# EAGLE design progr_voltage_src (EAGLE 9.6.2)
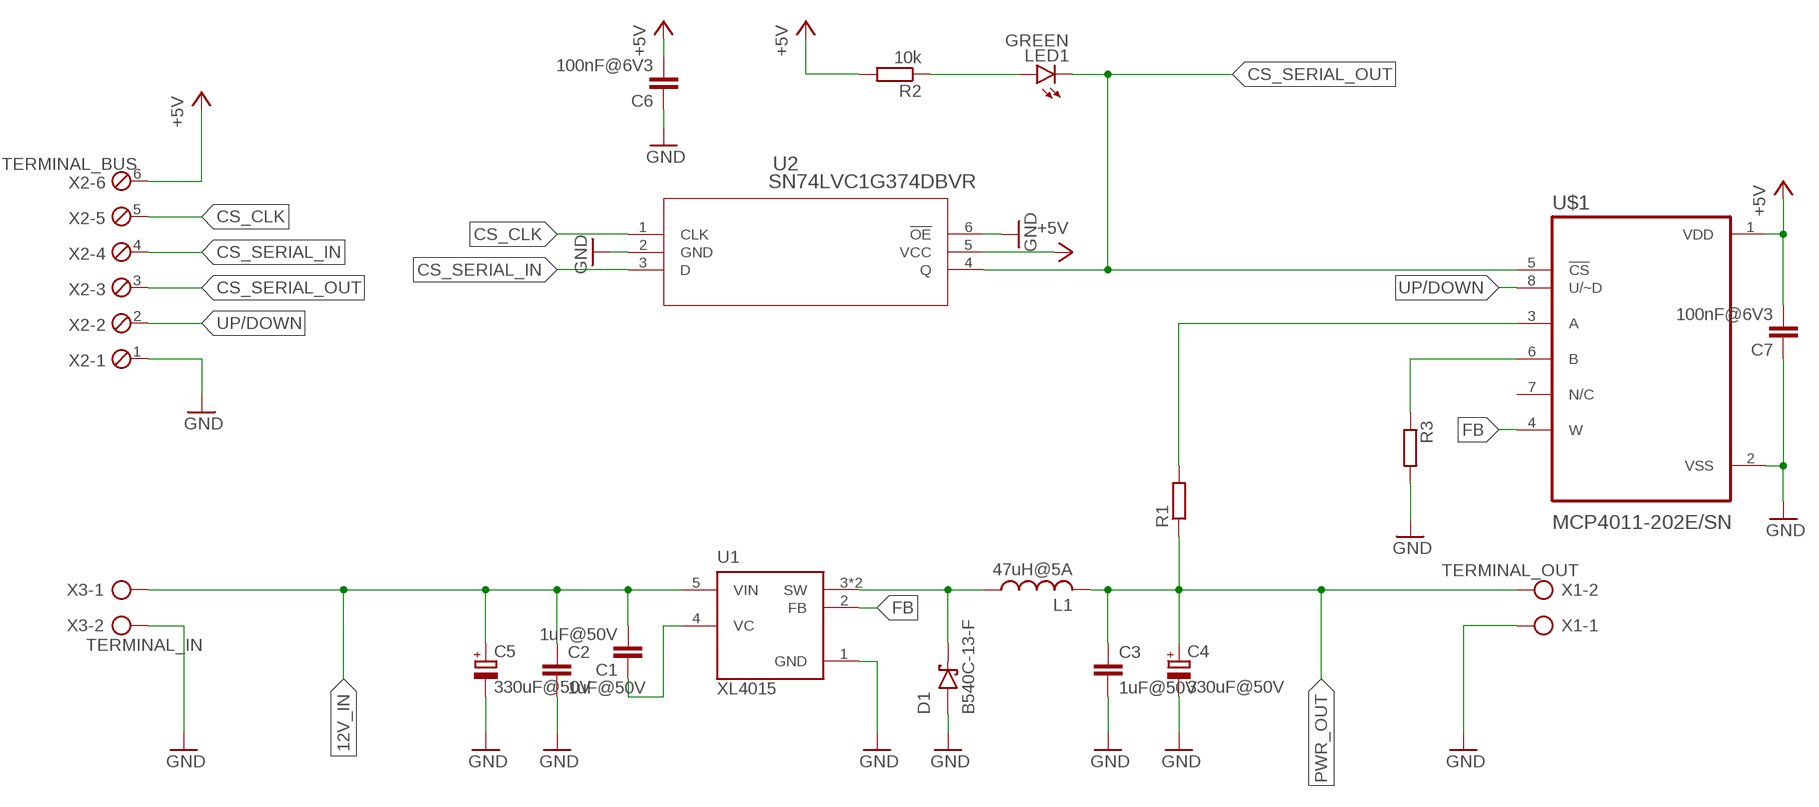
[diagram p0: schematic, sheet 1]

## Parts
C1  1uF@50V  C-EUC0603  [C0603]
C2  1uF@50V  C-EUC0603  [C0603]
C3  1uF@50V  C-EUC0603  [C0603]
C4  330uF@50V  CPOL-EUUD-6,3X7,7  [UD-6,3X7,7_NICHICON]
C5  330uF@50V  CPOL-EUUD-6,3X7,7  [UD-6,3X7,7_NICHICON]
C6  100nF@6V3  C-EUC0603  [C0603]
C7  100nF@6V3  C-EUC0603  [C0603]
D1  B540C-13-F  [DIOM6959X245N]
L1  47uH@5A  SMD_INDUCTOR_13X12X6  [SMD_INDUCTOR_13X12X6]
LED1  GREEN  LED3MM  [LED3MM]
R1  R-EU_R0603  [R0603]
R2  10k  R-EU_R0603  [R0603]
R3  R-EU_R0603  [R0603]
U1  XL4015  [CONV_XL4015]
U2  SN74LVC1G374DBVR  [DBV6]
U$1  MCP4011-202E/SN  [SOIC127P600X175-8N]
X1  TERMINAL_OUT  AK500/2  [AK500/2]
X2  TERMINAL_BUS  MPT6  [6POL254]
X3  TERMINAL_IN  AK500/2  [AK500/2]

## Nets
12V_IN: C1.2 C2.1 C5.+ U1.5(VIN) X3.1
+5V: C6.2 C7.2 R2.2 U2.5(VCC) U$1.1(VDD) X2.6
CS_CLK: U2.1(CLK) X2.5
CS_SERIAL_IN: U2.3(D) X2.4
CS_SERIAL_OUT: LED1.K(C) U2.4(Q) U$1.5(!CS) X2.3
FB: U1.2(FB) U$1.4(W)
GND: C2.2 C3.2 C4.- C5.- C6.1 C7.1 D1.A R3.2 U1.1(GND) U2.2(GND) U2.6(!OE) U$1.2(VSS) X1.1 X2.1 X3.2
N$1: D1.C(K) L1.P$1 U1.3(SW) U1.3.1(SW)
N$2: LED1.A R2.1
N$4: C1.1 U1.4(VC)
N$5: R3.1 U$1.6(B)
N$6: R1.2 U$1.3(A)
PWR_OUT: C3.1 C4.+ L1.P$2 R1.1 X1.2
UP/DOWN: U$1.8(U/~D) X2.2
Unconnected: U$1.7(N/C)

## Library data of the parts
C1-C3 C6 C7 = rcl:C-EU: CAPACITOR, European symbol; SPICEPREFIX: C
C4 C5 = rcl:CPOL-EU: POLARIZED CAPACITOR, European symbol; SPICEPREFIX: C
D1 = B540C-13-F:B540C-13-F: Diode, Schottky, 5a, 40v, Do-214ab-2, Full Reel Check availability <https://pricing.snapeda.com/parts/B540C-13-F/Diodes%20Inc./view-part?ref=eda>; AVAILABILITY: In Stock; CHECK_PRICES: https://www.snapeda.com/parts/B540C-13-F/Diodes+Inc./view-part/?ref=eda; DESCRIPTION: Diode Schottky 40 V 5A Surface Mount SMC; MF: Diodes Inc.; MP: B540C-13-F; PACKAGE: DO-214 Diodes Inc.; PRICE: None; PURCHASE-URL: https://pricing.snapeda.com/search?q=B540C-13-F&ref=eda; SNAPEDA_LINK: https://www.snapeda.com/parts/B540C-13-F/Diodes+Inc./view-part/?ref=snap
L1 = SMD_INDUCTOR_13X12X6:SMD_INDUCTOR_13X12X6
LED1 = led:LED: LED OSRAM: - CHIPLED LG R971, LG N971, LY N971, LG Q971, LY Q971, LO R971, LY R971 LH N974, LH R974 LS Q976, LO Q976, LY Q976 LO Q996 - Hyper CHIPLED LW Q18S LB Q993, LB Q99A, LB R99A - SideLED LS A670, LO A670, LY A670, LG A670, LP A670 LB A673, LV A673, LT A673, LW A673 LH A674 LY A675 LS A676, LA A676, LO A676, LY A676, LW A676 LS A679, LY A679, LG A679 - Hyper Micro SIDELED® LS Y876, LA Y876, LO Y876, LY Y876 LT Y87S - SmartLED LW L88C, LW L88S LB L89C, LB L89S, LG L890 LS L89K, LO L89K, LY L89K LS L896, LA L896, LO L896, LY L896 - TOPLED LS T670, LO T670, LY T670, LG T670, LP T670 LSG T670, LSP T670, LSY T670, LOP T670, LYG T670 LG T671, LOG T671, LSG T671 LB T673, LV T673, LT T673, LW T673 LH T674 LS T676, LA T676, LO T676, LY T676, LB T676, LH T676, LSB T676, LW T676 LB T67C, LV T67C, LT T67C, LS T67K, LO T67K, LY T67K, LW E67C LS E67B, LA E67B, LO E67B, LY E67B, LB E67C, LV E67C, LT E67C LW T67C LS T679, LY T679, LG T679 LS T770, LO T770, LY T770, LG T770, LP T770 LB T773, LV T773, LT T773, LW T773 LH T774 LS E675, LA E675, LY E675, LS T675 LS T776, LA T776, LO T776, LY T776, LB T776 LHGB T686 LT T68C, LB T68C - Hyper Mini TOPLED® LB M676 - Mini TOPLED Santana® LG M470 LS M47K, LO M47K, LY M47K Source: http://www.osram.convergy.de LUXEON: - LUMILED® LXK2-PW12-R00, LXK2-PW12-S00, LXK2-PW14-U00, LXK2-PW14-V00 LXK2-PM12-R00, LXK2-PM12-S00, LXK2-PM14-U00 LXK2-PE12-Q00, LXK2-PE12-R00, LXK2-PE12-S00, LXK2-PE14-T00, LXK2-PE14-U00 LXK2-PB12-K00, LXK2-PB12-L00, LXK2-PB12-M00, LXK2-PB14-N00, LXK2-PB14-P00, LXK2-PB14-Q00 LXK2-PR12-L00, LXK2-PR12-M00, LXK2-PR14-Q00, LXK2-PR14-R00 LXK2-PD12-Q00, LXK2-PD12-R00, LXK2-PD12-S00 LXK2-PH12-R00, LXK2-PH12-S00 LXK2-PL12-P00, LXK2-PL12-Q00, LXK2-PL12-R00 Source: www.luxeon.com KINGBRIGHT: KA-3528ASYC Source: www.kingbright.com
R1-R3 = rcl:R-EU_: RESISTOR, European symbol; SPICEPREFIX: R
U1 = XL4015:XL4015: 5A 180KHz 36V Buck DC to DC Converter Check availability <https://pricing.snapeda.com/parts/XL4015/XLSEMI/view-part?ref=eda>; AVAILABILITY: Not in stock; CHECK_PRICES: https://www.snapeda.com/parts/XL4015/XLSEMI/view-part/?ref=eda; DESCRIPTION: 5A 180KHz 36V Buck DC to DC Converter; MF: XLSEMI; MP: XL4015; PACKAGE: None; PRICE: None; SNAPEDA_LINK: https://www.snapeda.com/parts/XL4015/XLSEMI/view-part/?ref=snap
U2 = SN74LVC1G374:SN74LVC1G374DBVR; COPYRIGHT: Copyright (C) 2023 Ultra Librarian. All rights reserved.; MANUFACTURER_PART_NUMBER: SN74LVC1G374DBVR; MFR_NAME: Texas Instruments
U$1 = MCP4011-202E_SN:MCP4011-202E/SN: Check availability <https://pricing.snapeda.com/parts/MCP4011-202E/SN/Microchip/view-part?ref=eda>; AVAILABILITY: In Stock; CHECK_PRICES: https://www.snapeda.com/parts/MCP4011-202E/SN/Microchip/view-part/?ref=eda; DESCRIPTION: Digital Potentiometer 2.1k Ohm 1 Circuit 64 Taps Up/Down (U/D, CS) Interface 8-SOIC; MF: Microchip; MP: MCP4011-202E/SN; PACKAGE: SOIC-8 Microchip; PRICE: None; PURCHASE-URL: https://pricing.snapeda.com/search?q=MCP4011-202E/SN&ref=eda; SNAPEDA_LINK: https://www.snapeda.com/parts/MCP4011-202E/SN/Microchip/view-part/?ref=snap
X1 X3 = con-ptr500:AK500/2: CONNECTOR; OC_FARNELL: unknown; OC_NEWARK: unknown
X2 = con-phoenix-254:MPT6: PHOENIX CONNECTOR; OC_FARNELL: unknown; OC_NEWARK: unknown

## Board
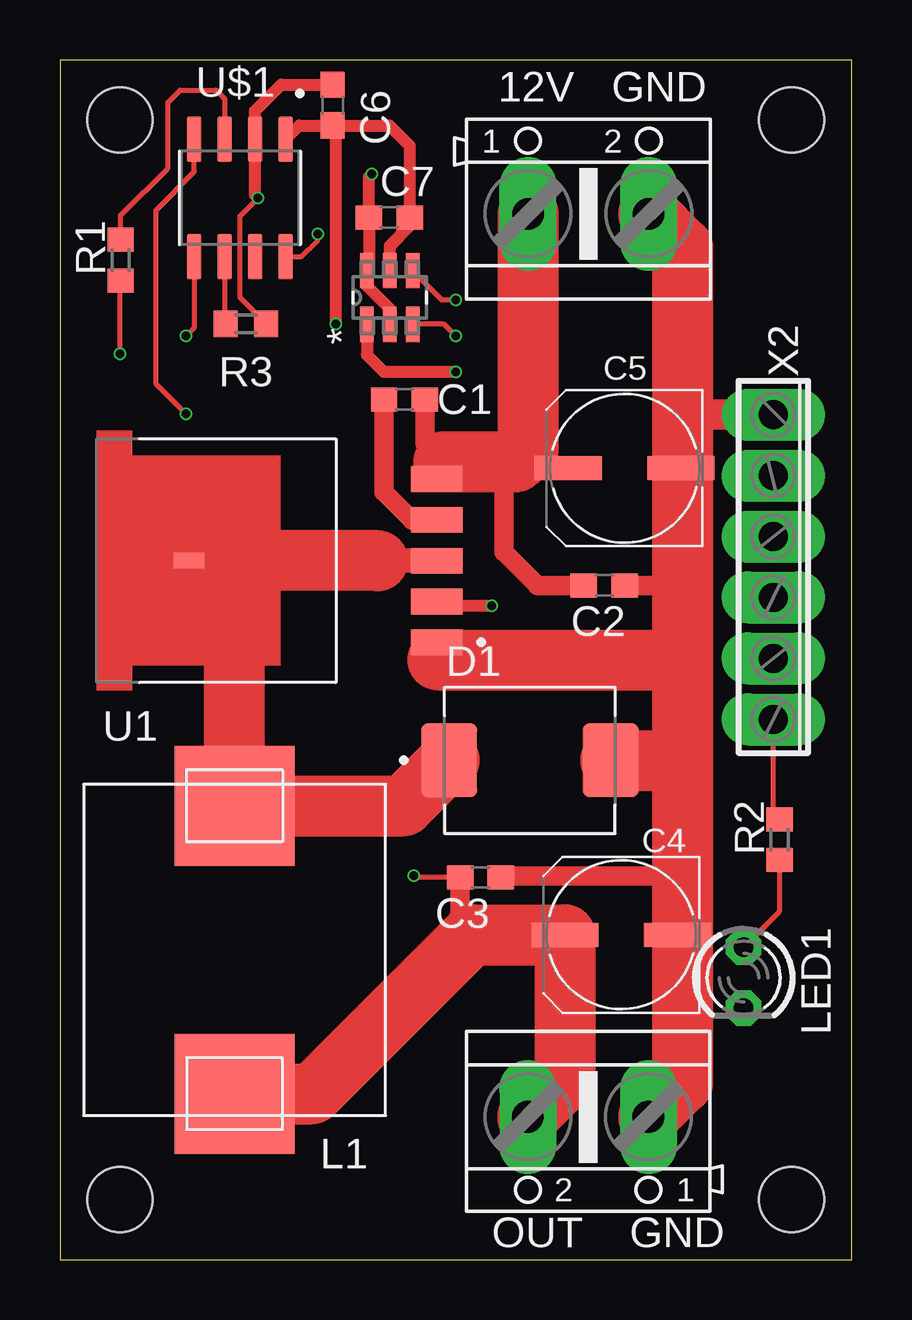
[diagram p1: board, top side]
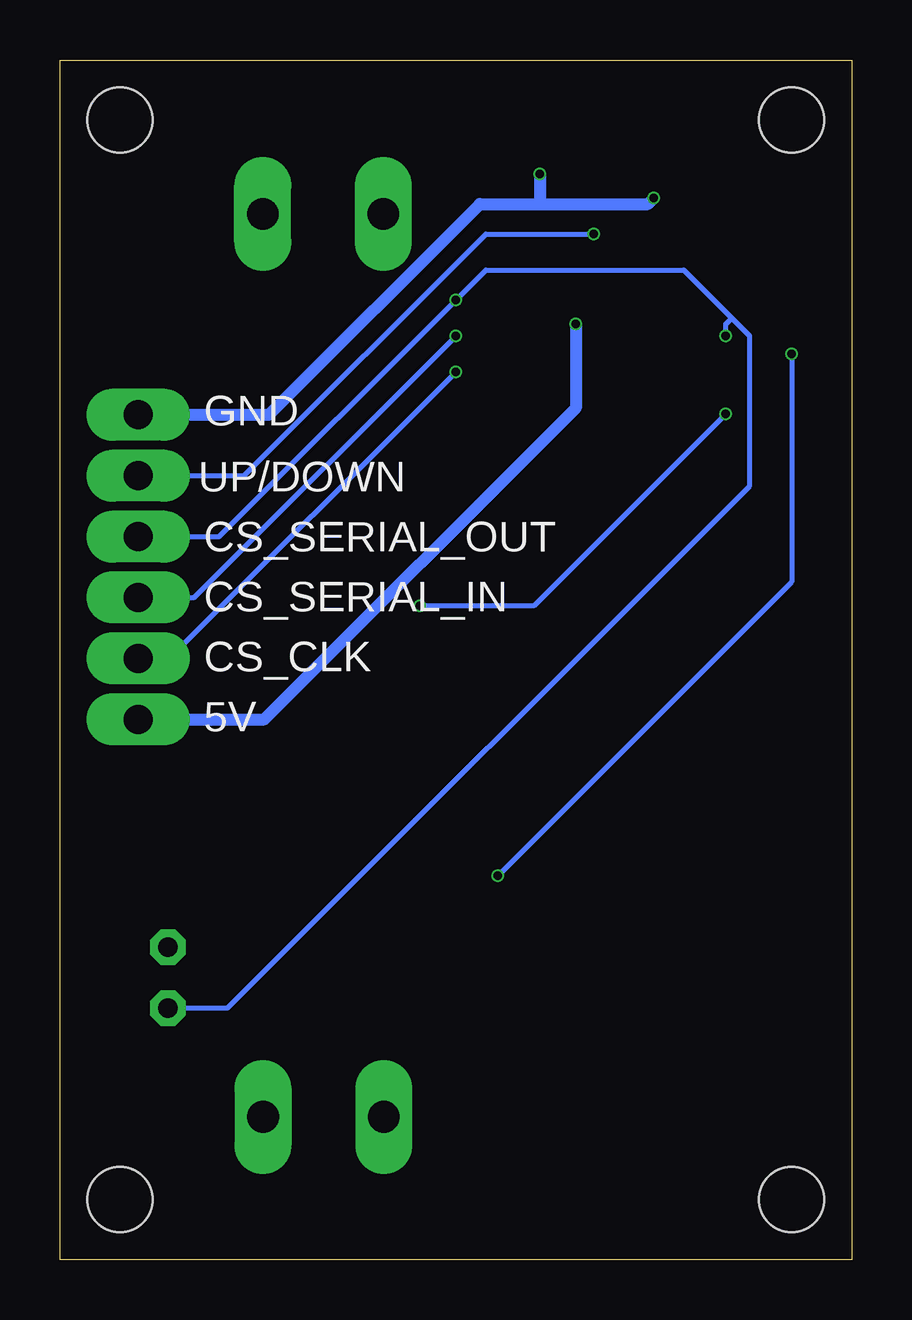
[diagram p2: board, bottom side, seen from below]

Size 33 x 50 mm. Coordinates in mm from the lower left corner, seen from the top.
Outline: 0,0 33,0 33,50 0,50 0,0
Copper layers (1*16): Top 0.035mm / dielectric 1.6mm / Bottom 0.035mm
Design rules "jlcpcb-2layers": minimum track width 5mil, minimum drill 0.3mm, track to track 5mil, track to pad 5mil, pad to pad 5mil, via to via 5mil, smd to smd 5mil, copper to edge 0.2mm, drill to drill 6mil, minimum pad ring 10mil, minimum via ring 3mil, stop-mask expansion 4mil, vias tented up to drill 0mil, thermal gap 10mil
Holes 2.7 mm at 2.5,47.5 30.5,47.5 2.5,2.5 30.5,2.5

### Footprints (pad centres in the part's own frame; a part is rotated, then mirrored left to right if it is on the bottom)
C0603 = smd 1.1 x 1: 1 -0.85,0; 2 0.85,0
UD-6,3X7,7_NICHICON = smd 2.8 x 1: + 2.35,0; - -2.35,0
DIOM6959X245N = smd 2.33 x 3.07: A 3.365,0; C -3.365,0
SMD_INDUCTOR_13X12X6 = smd 5 x 5: P$1 -6,0; P$2 6,0
LED3MM = drill 0.813 octagon: A -1.27,0; K 1.27,0
R0603 = smd 1 x 1.1: 1 -0.85,0; 2 0.85,0
CONV_XL4015 = smd 2.16 x 1.07: 1 -10.335,3.4; 2 -10.335,1.7; 3 -10.335,0; 4 -10.335,-1.7; 5 -10.335,-3.4 | smd 1.27 x 0.635: 3.1 0,0
DBV6 = smd 1.473 x 0.559: 1 -1.118,0.95; 2 -1.118,0; 3 -1.118,-0.95; 4 1.118,-0.95; 5 1.118,0; 6 1.118,0.95
SOIC127P600X175-8N = smd 1.9 x 0.6: 1 -2.455,1.905; 2 -2.455,0.635; 3 -2.455,-0.635; 4 -2.455,-1.905; 5 2.455,-1.905; 6 2.455,-0.635; 7 2.455,0.635; 8 2.455,1.905
AK500/2 = drill 1.321 long: 1 -2.515,0; 2 2.515,0
6POL254 = drill 1.2 pad 1.778 long: 1 -6.35,0; 2 -3.81,0; 3 -1.27,0; 4 1.27,0; 5 3.81,0; 6 6.35,0

### Placement (x,y rotation side)
C1  14.36,35.84 0 top
C2  22.69,28.09 0 top
C3  17.53,15.92 0 top
C4  23.4,13.54 180 top
C5  23.54,32.98 180 top
C6  11.37,48.12 270 top
C7  13.73,43.43 0 top
D1  19.59,20.81 0 top
L1  7.28,12.91 270 top
LED1  28.5,11.75 270 top
R1  2.53,41.66 90 top
R2  30,17.5 90 top
R3  7.75,39 0 top
U1  5.37,29.13 180 top
U2  13.75,40.1 90 top
U$1  7.5,44.25 270 top
X1  22.02,5.95 180 top
X2  29.74,28.86 270 top
X3  22.03,43.59 0 top

### Tracks (layer width: path | path; a pad name or v marks a point on that pad's centre or on a via)
12V_IN
  Top 0.813: C5.+ 19.27,32.98 19,33.25 18.5,32.75 18.5,29.5 19.91,28.09 C2.1 | C1.2 15.21,34.04 15.71,33.55 | 15.71,33.55 16,33.25 | U1.5 15.71,33.55
  Top 2.54: 16,33.25 19,33.25 19.52,33.77 X3.1
+5V  (via drill 0.35)
  Top 0.203: 29.74,18.61 X2.6
  Top 0.508: R2.2 29.74,18.61 | U2.5 13.75,42.25 14.58,43.08 C7.2 14.58,46.42 13.73,47.27 C6.2 | v11.5,39 11.5,47.14 C6.2 | U$1.1 9.97,47.27 C6.2
  Bottom 0.508: X2.6 24.48,22.52 11.5,35.5 v11.5,39
CS_CLK  (via drill 0.35)
  Top 0.508: v16.5,37 13.5,37 12.8,37.7 U2.1
  Bottom 0.203: X2.5 28.45,25.05 v16.5,37
CS_SERIAL_IN  (via drill 0.35)
  Top 0.203: v16.5,38.5 16.02,38.98 U2.3
  Bottom 0.203: X2.4 27.41,27.59 v16.5,38.5
CS_SERIAL_OUT  (via drill 0.35)
  Top 0.203: U2.4 15.92,40 v16.5,40 | U$1.5 5.59,38.84 v5.25,38.5
  Bottom 0.203: X2.3 26.36,30.14 v16.5,40 15.25,41.25 7,41.25 5,39.25 | LED1.K 26.02,10.48 4.25,32.25 4.25,38.5 5,39.25 | v5.25,38.5 5.25,39 5,39.25
FB  (via drill 0.35)
  Top 0.203: v5.25,35.25 4.75,35.75 4,36.5 4,43.75 5.59,45.34 U$1.4
  Top 0.508: v18,27.25 15.88,27.25 U1.2
  Bottom 0.203: v5.25,35.25 13.25,27.25 v18,27.25
GND  (via drill 0.35)
  Top 0.203: R3.2 7.5,40.1 7.5,43.5 v8.25,44.25
  Top 0.508: U2.2 13.75,39.62 12.8,40.57 U2.6 12.88,41.3 C7.1 12.88,45.13 v13,45.25 | U1.1 15.75,25.68 15.75,25 | C4.- 25.95,13.34 25.95,13.25 | v8.25,44.25 8.13,44.37 U$1.2 8.13,47.88 9.22,48.97 C6.1
  Top 0.813: C5.- 25.95,33.04 25.95,33.25 | C2.2 25.86,28.09 25.95,28 | C3.2 18.46,16 25.95,16
  Top 1.27: X2.1 26.98,35.22 25.95,36.25
  Top 2.54: X3.2 25.95,42.19 25.95,36.25 25.95,33.25 25.95,28 25.95,25.5 | X1.1 25.95,7.36 25.95,13.25 25.95,16 25.95,20.81 | 25.95,25.5 25.95,20.81 | 25.95,25.5 25.45,25 15.75,25 | D1.A 25.95,20.81
  Bottom 0.508: v8.25,44.25 8.5,44 13,44 | 13,44 15.5,44 24.29,35.22 X2.1 | v13,45.25 13,44
N$1
  Top 1.016: U1.3 13.25,29.13 | 7.25,29.13 6,29.13 U1.3.1
  Top 2.54: 13.25,29.13 7.25,29.13 | 6,29.13 7.28,27.85 L1.P$1 14.32,18.91 D1.C
N$2
  Top 0.203: LED1.A 30,14.52 R2.1
N$4
  Top 0.813: C1.1 13.51,31.99 14.67,30.83 U1.4
N$5
  Top 0.203: U$1.6 6.87,39.03 R3.1
N$6
  Top 0.203: R1.2 2.53,43.53 4.5,45.5 4.5,48.25 5,48.75 6.5,48.75 6.87,48.38 U$1.3
PWR_OUT  (via drill 0.35)
  Top 0.203: C3.1 14.83,15.92 v14.75,16 | v2.5,37.75 2.5,40.78
  Top 0.406: 2.5,40.78 R1.1
  Top 0.813: C3.1 16.68,14.02 17.16,13.54
  Top 2.54: X1.2 21.05,7.49 C4.+ 17.16,13.54 10.53,6.91 L1.P$2
  Bottom 0.203: v14.75,16 2.5,28.25 v2.5,37.75
UP/DOWN  (via drill 0.35)
  Top 0.203: U$1.8 10.04,41.8 10.75,42.5 v10.75,42.75
  Bottom 0.203: X2.2 25.32,32.67 15.25,42.75 v10.75,42.75

### Text on the board
tNames: 12V | GND | OUT | GND
bNames: GND | UP/DOWN | CS_SERIAL_OUT | CS_SERIAL_IN | CS_CLK | 5V